# Altium project Intermediate_LCL_Updated.PrjPcb (part 2 of 2)
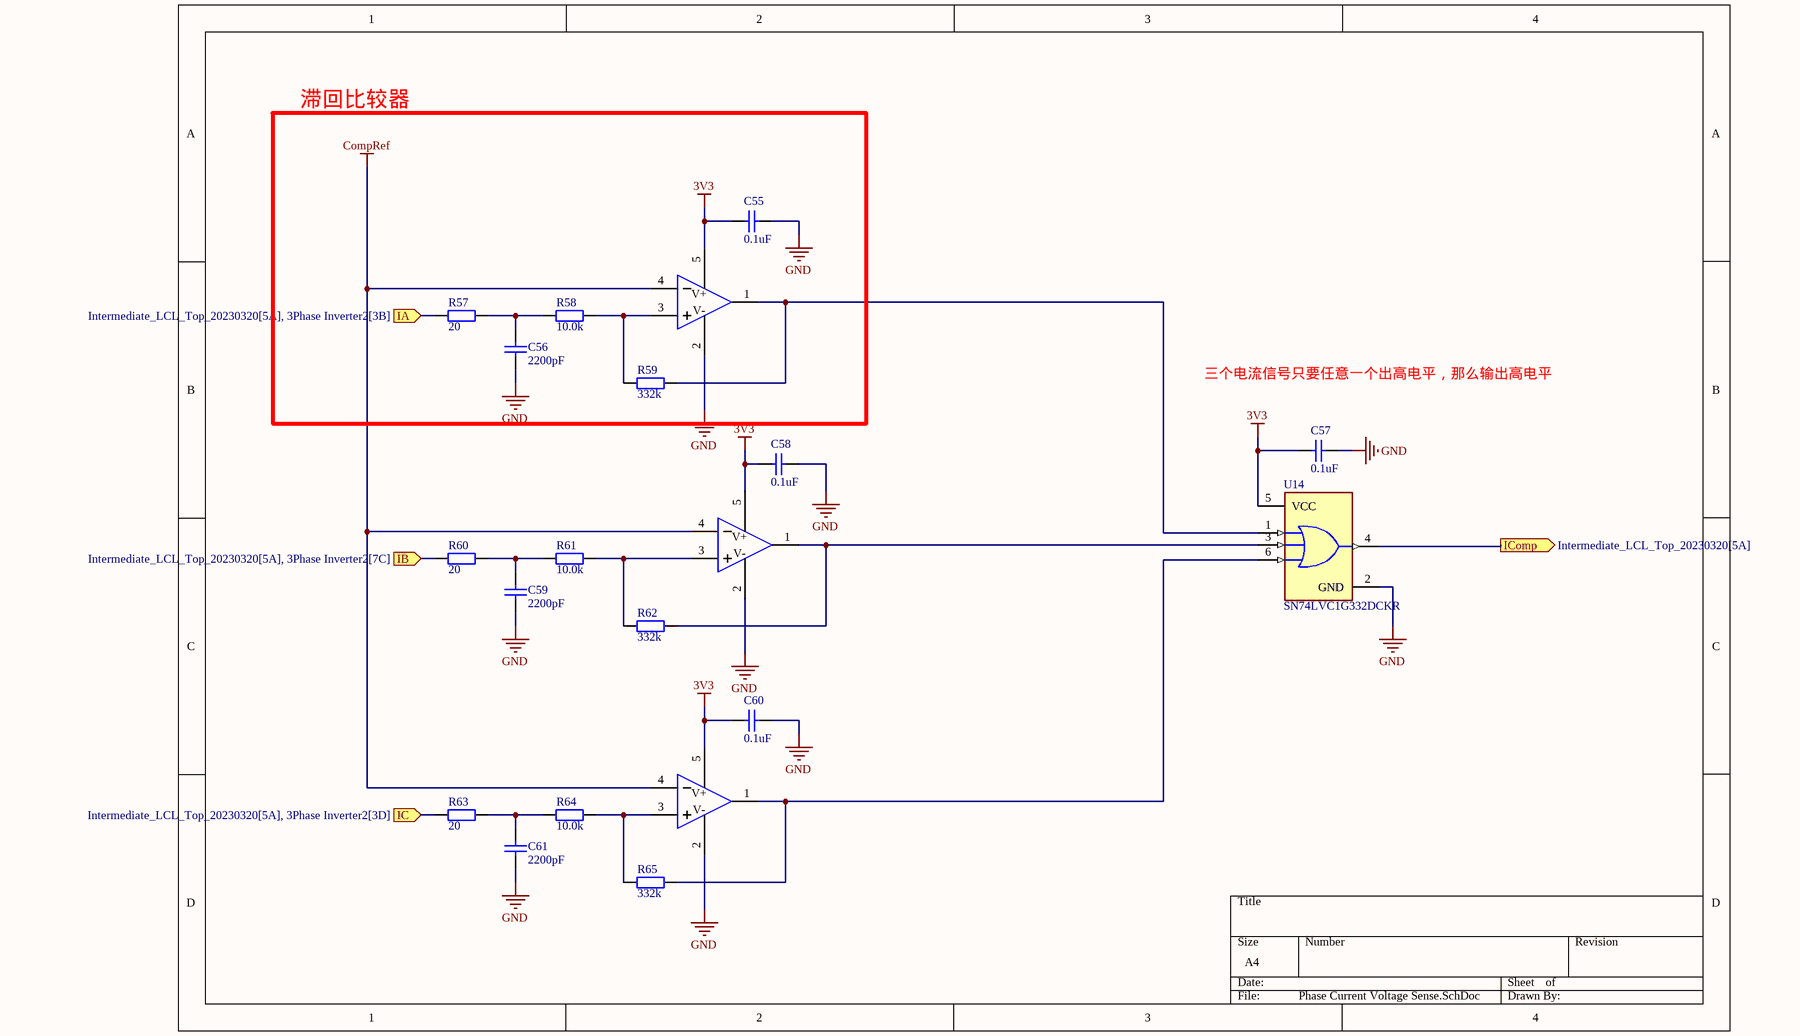
[diagram p14: Phase Current Voltage Sense.SchDoc]

## Nets that join several sheets
3.3A: Intermediate_LCL_Top_20230320 (C1.2 R1.2), LaunchPad Connectors (R77.2)
3.3B: Intermediate_LCL_Top_20230320 (C11.2 J2.15 R7#1.2), LaunchPad Connectors (R106.2)
3V3: LaunchPad Connectors (22 pins), power (9 pins), U_1231 (6 pins), U_1232 (6 pins), U_Phase Current Voltage Sense1 (8 pins), U_Phase Current Voltage Sense2 (8 pins)
5V: LaunchPad Connectors (R67.2 R101#1.2), power (9 pins), U_3Phase Inverter1 (R124_1.2 R127_1.2 R130_1.2), U_3Phase Inverter2 (R124_2.2 R127_2.2 R130_2.2)
+15V: Intermediate_LCL_Top_20230320 (16 pins), LCL_11 (C23_1.2 C24_1.2 U5_1.3), LCL_12 (C23_2.2 C24_2.2 U5_2.3), LCL_13 (C23_3.2 C24_3.2 U5_3.3), LCL_21 (C28_1.2 C29_1.2 U6_1.3), LCL_22 (C28_2.2 C29_2.2 U6_2.3), LCL_23 (C28_3.2 C29_3.2 U6_3.3)
-15V: Intermediate_LCL_Top_20230320 (16 pins), LCL_11 (C25_1.2 C26_1.2 U5_1.4), LCL_12 (C25_2.2 C26_2.2 U5_2.4), LCL_13 (C25_3.2 C26_3.2 U5_3.4), LCL_21 (C30_1.2 C31_1.2 U6_1.4), LCL_22 (C30_2.2 C31_2.2 U6_2.4), LCL_23 (C30_3.2 C31_3.2 U6_3.4)
C1_Neut: LCL_11 (C22_1.1 U5_1.1), LCL_12 (C22_2.1 U5_2.1), LCL_13 (C22_3.1 U5_3.1)
C2_Neut: LCL_21 (C27_1.1 U6_1.1), LCL_22 (C27_2.1 U6_2.1), LCL_23 (C27_3.1 U6_3.1)
CompRef: U_Phase Current Voltage Sense1 (U13_1.4 U15_1.4 U16_1.4), U_Phase Current Voltage Sense2 (U13_2.4 U15_2.4 U16_2.4)
EPWM1A: Intermediate_LCL_Top_20230320 (J3.01), LaunchPad Connectors (R118.2 U19.3)
EPWM1B: Intermediate_LCL_Top_20230320 (J3.03), LaunchPad Connectors (R117.2 U19.4)
EPWM2A: Intermediate_LCL_Top_20230320 (J3.05), LaunchPad Connectors (R116.1 U19.5)
EPWM2B: Intermediate_LCL_Top_20230320 (J3.07), LaunchPad Connectors (R115.2 U19.6)
EPWM3A: Intermediate_LCL_Top_20230320 (J3.09), LaunchPad Connectors (R114.2 U19.7)
EPWM3B: Intermediate_LCL_Top_20230320 (J3.11), LaunchPad Connectors (R113.2 U19.8)
EPWM4A: Intermediate_LCL_Top_20230320 (J3.13), LaunchPad Connectors (R89#1.2 U17.3)
EPWM4B: Intermediate_LCL_Top_20230320 (J3.15), LaunchPad Connectors (R88#1.2 U17.4)
EPWM5A: Intermediate_LCL_Top_20230320 (J3.17), LaunchPad Connectors (R87#1.1 U17.5)
EPWM5B: Intermediate_LCL_Top_20230320 (J3.19), LaunchPad Connectors (R86#1.2 U17.6)
EPWM6A: Intermediate_LCL_Top_20230320 (J3.21), LaunchPad Connectors (R85.2 U17.7)
EPWM6B: Intermediate_LCL_Top_20230320 (J3.23), LaunchPad Connectors (R84#1.2 U17.8)
GND: Intermediate_LCL_Top_20230320 (70 pins), LCL_11 (5 pins), LCL_12 (5 pins), LCL_13 (5 pins), LCL_21 (5 pins), LCL_22 (5 pins), LCL_23 (5 pins), Fdbk_21 (R20_1.1), Fdbk_22 (R20_2.1), Fdbk_23 (R20_3.1), LaunchPad Connectors (62 pins), power (29 pins), U_3Phase Inverter1 (12 pins), U_3Phase Inverter2 (12 pins), U_1231 (21 pins), U_1232 (21 pins), U_Phase Current Voltage Sense1 (11 pins), U_Phase Current Voltage Sense2 (11 pins)
I_InB_1: Fdbk_21 (R19_1.1), LaunchPad Connectors (C78.1 R99.2)
I_InB_2: Fdbk_22 (R19_2.1), LaunchPad Connectors (C82.1 R102#1.2)
I_InB_3: Fdbk_23 (R19_3.1), LaunchPad Connectors (C79.1 R103.2)
IA1: LaunchPad Connectors (R73.1), U_1231 (U24_1.8), U_Phase Current Voltage Sense1 (R57_1.2)
IA2: LaunchPad Connectors (R99.1), U_1232 (U24_2.8), U_Phase Current Voltage Sense2 (R57_2.2)
IB1: LaunchPad Connectors (R74.1), U_1231 (U25_1.8), U_Phase Current Voltage Sense1 (R60_1.2)
IB2: LaunchPad Connectors (R102#1.1), U_1232 (U25_2.8), U_Phase Current Voltage Sense2 (R60_2.2)
IC1: LaunchPad Connectors (R75.1), U_1231 (U26_1.8), U_Phase Current Voltage Sense1 (R63_1.2)
IC2: LaunchPad Connectors (R103.1), U_1232 (U26_2.8), U_Phase Current Voltage Sense2 (R63_2.2)
IComp1: LaunchPad Connectors (R93#1.1), U_Phase Current Voltage Sense1 (U14_1.4)
IComp2: LaunchPad Connectors (R122.1), U_Phase Current Voltage Sense2 (U14_2.4)
PGND: power (5 pins), U_3Phase Inverter1 (15 pins), U_3Phase Inverter2 (15 pins)
PWM_AH1: LaunchPad Connectors (R78.1 U17.21), U_3Phase Inverter1 (R131_1.2)
PWM_AH2: LaunchPad Connectors (R107.1 U19.21), U_3Phase Inverter2 (R131_2.2)
PWM_AL1: LaunchPad Connectors (R79.1 U17.20), U_3Phase Inverter1 (R132_1.2)
PWM_AL2: LaunchPad Connectors (R108.1 U19.20), U_3Phase Inverter2 (R132_2.2)
PWM_BH1: LaunchPad Connectors (R80.1 U17.19), U_3Phase Inverter1 (R125_1.2)
PWM_BH2: LaunchPad Connectors (R109.1 U19.19), U_3Phase Inverter2 (R125_2.2)
PWM_BL1: LaunchPad Connectors (R81.1 U17.18), U_3Phase Inverter1 (R126_1.2)
PWM_BL2: LaunchPad Connectors (R110.1 U19.18), U_3Phase Inverter2 (R126_2.2)
PWM_CH1: LaunchPad Connectors (R82.1 U17.17), U_3Phase Inverter1 (R128_1.2)
PWM_CH2: LaunchPad Connectors (R111.1 U19.17), U_3Phase Inverter2 (R128_2.2)
PWM_CL1: LaunchPad Connectors (R83#1.1 U17.16), U_3Phase Inverter1 (R129_1.2)
PWM_CL2: LaunchPad Connectors (R112.1 U19.16), U_3Phase Inverter2 (R129_2.2)
PWM_EN_1: Intermediate_LCL_Top_20230320 (J3.35 TP12.1), LaunchPad Connectors (R92#1.2 U18.1)
PWM_EN_2: Intermediate_LCL_Top_20230320 (J3.47 TP18.1), LaunchPad Connectors (R121.2 U20.1)
VA1: LaunchPad Connectors (R69.1), U_1231 (C108_1.1 R134_1.1 R137_1.2)
VA2: LaunchPad Connectors (R96.1), U_1232 (C108_2.1 R134_2.1 R137_2.2)
VB1: LaunchPad Connectors (R71.1), U_1231 (C112_1.1 R140_1.1 R143_1.2)
VB2: LaunchPad Connectors (R97.1), U_1232 (C112_2.1 R140_2.1 R143_2.2)
VBUS: power (7 pins), U_3Phase Inverter1 (15 pins), U_3Phase Inverter2 (15 pins)
VC1: LaunchPad Connectors (R72.1), U_1231 (C116_1.1 R146_1.1 R149_1.2)
VC2: LaunchPad Connectors (R98.1), U_1232 (C116_2.1 R146_2.1 R149_2.2)
VDCA_In: Intermediate_LCL_Top_20230320 (R5.1), LaunchPad Connectors (C65.1 D1.2 R68.2)
VDCB_In: Intermediate_LCL_Top_20230320 (R11.1), LaunchPad Connectors (C76.1 D5.2 R95.2)
VREF1: U_1231 (6 pins), U_1232 (6 pins)
VREFA: Intermediate_LCL_Top_20230320 (J2.33), LaunchPad Connectors (C64.1 R76.2 R77.1)
1.65B: Intermediate_LCL_Top_20230320 (U3.1 U3.2), Fdbk_21 (R18_1.1), Fdbk_22 (R18_2.1), Fdbk_23 (R18_3.1)
I_NegB_1: Intermediate_LCL_Top_20230320 (U3.6), Fdbk_21 (R17_1.1 R18_1.2)
I_NegB_2: Intermediate_LCL_Top_20230320 (U3.9), Fdbk_22 (R17_2.1 R18_2.2)
I_NegB_3: Intermediate_LCL_Top_20230320 (U3.13), Fdbk_23 (R17_3.1 R18_3.2)
I_OutB_1: Intermediate_LCL_Top_20230320 (J2.05 TP2.1 U3.7), Fdbk_21 (R17_1.2)
I_OutB_2: Intermediate_LCL_Top_20230320 (J2.07 TP3.1 U3.8), Fdbk_22 (R17_2.2)
I_OutB_3: Intermediate_LCL_Top_20230320 (J2.03 TP1.1 U3.14), Fdbk_23 (R17_3.2)
I_PosB_1: Intermediate_LCL_Top_20230320 (U3.5), Fdbk_21 (R19_1.2 R20_1.2)
I_PosB_2: Intermediate_LCL_Top_20230320 (U3.10), Fdbk_22 (R19_2.2 R20_2.2)
I_PosB_3: Intermediate_LCL_Top_20230320 (U3.12), Fdbk_23 (R19_3.2 R20_3.2)
Ph-A1: U_3Phase Inverter1 (U23_1.8), U_1231 (R133_1.2 R135_1.1)
Ph-A2: U_3Phase Inverter2 (U23_2.8), U_1232 (R133_2.2 R135_2.1)
Ph-B1: U_3Phase Inverter1 (U21_1.8), U_1231 (R139_1.2 R141_1.1)
Ph-B2: U_3Phase Inverter2 (U21_2.8), U_1232 (R139_2.2 R141_2.1)
Ph-C1: U_3Phase Inverter1 (U22_1.8), U_1231 (R145_1.2 R147_1.1)
Ph-C2: U_3Phase Inverter2 (U22_2.8), U_1232 (R145_2.2 R147_2.1)
V_capA: Intermediate_LCL_Top_20230320 (J2.27 TP8.1), LCL_11 (R14_1.2 U5_1.2)
V_capA: Intermediate_LCL_Top_20230320 (J2.29 TP9.1), LCL_12 (R14_2.2 U5_2.2)
V_capA: Intermediate_LCL_Top_20230320 (J2.31 TP10.1), LCL_13 (R14_3.2 U5_3.2)
V_capB: Intermediate_LCL_Top_20230320 (J2.17 TP5.1), LCL_21 (R16_1.2 U6_1.2)
V_capB: Intermediate_LCL_Top_20230320 (J2.19 TP6.1), LCL_22 (R16_2.2 U6_2.2)
V_capB: Intermediate_LCL_Top_20230320 (J2.21 TP7.1), LCL_23 (R16_3.2 U6_3.2)
V_o_outA: Intermediate_LCL_Top_20230320 (J4.1), LCL_13 (L4_3.2)
V_o_outA: Intermediate_LCL_Top_20230320 (J4.2), LCL_12 (L4_2.2)
V_o_outA: Intermediate_LCL_Top_20230320 (J4.3), LCL_11 (L4_1.2)
V_o_outB: Intermediate_LCL_Top_20230320 (J7.1), LCL_23 (L6_3.2)
V_o_outB: Intermediate_LCL_Top_20230320 (J7.2), LCL_22 (L6_2.2)
V_o_outB: Intermediate_LCL_Top_20230320 (J7.3), LCL_21 (L6_1.2)
V_termA_1: Intermediate_LCL_Top_20230320 (L1#1.4), LCL_11 (L3_1.1)
V_termA_2: Intermediate_LCL_Top_20230320 (L1#1.5), LCL_12 (L3_2.1)
V_termA_3: Intermediate_LCL_Top_20230320 (L1#1.6), LCL_13 (L3_3.1)
V_termB_1: Intermediate_LCL_Top_20230320 (L2.4), LCL_21 (L5_1.1)
V_termB_2: Intermediate_LCL_Top_20230320 (L2.5), LCL_22 (L5_2.1)
V_termB_3: Intermediate_LCL_Top_20230320 (L2.6), LCL_23 (L5_3.1)